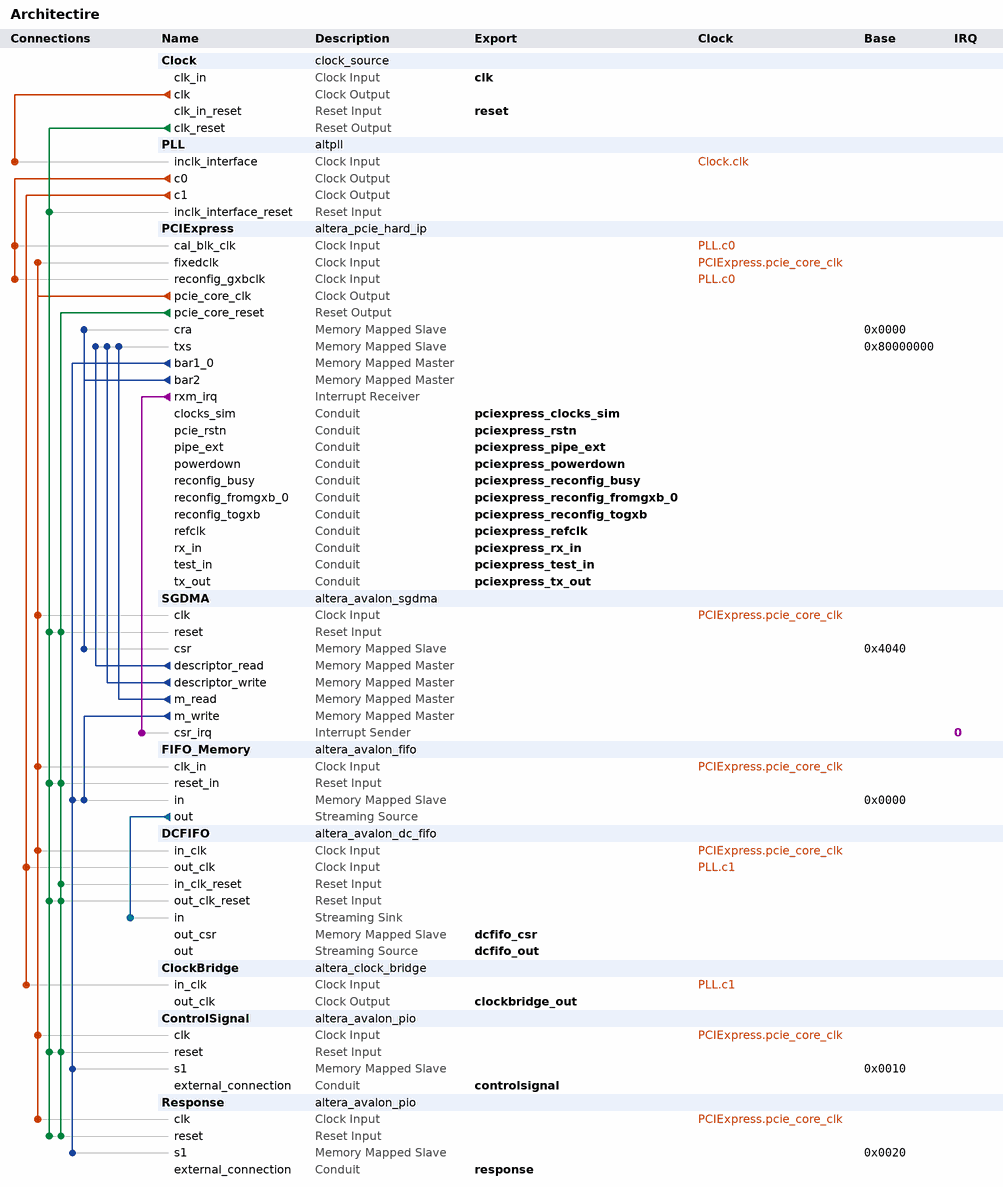
[diagram p0: system contents]
# Platform Designer (Qsys) system Architectire, Cyclone IV GX EP4CGX150DF31C7
# Parameters at their usual value, and those the tool derives, are not listed.
package require -exact qsys 15.0
create_system Architectire
set_project_property DEVICE_FAMILY {Cyclone IV GX}
set_project_property DEVICE EP4CGX150DF31C7

add_instance Clock clock_source 15.0
set_instance_parameter_value Clock clockFrequency 50000000

add_instance PLL altpll 15.0
set_instance_parameter_value PLL CLK0_DIVIDE_BY 1
set_instance_parameter_value PLL CLK0_MULTIPLY_BY 1
set_instance_parameter_value PLL CLK1_DIVIDE_BY 1
set_instance_parameter_value PLL CLK1_DUTY_CYCLE 50
set_instance_parameter_value PLL CLK1_MULTIPLY_BY 4
set_instance_parameter_value PLL CLK1_PHASE_SHIFT 0
set_instance_parameter_value PLL INCLK0_INPUT_FREQUENCY 20000
set_instance_parameter_value PLL PORT_ARESET PORT_UNUSED
set_instance_parameter_value PLL PORT_LOCKED PORT_UNUSED
set_instance_parameter_value PLL PORT_clk1 PORT_USED
set_instance_parameter_value PLL PORT_clk2 PORT_UNUSED
set_instance_parameter_value PLL PORT_clk3 PORT_UNUSED

add_instance PCIExpress altera_pcie_hard_ip 15.0
set_instance_parameter_value PCIExpress {BAR Type} {64 bit Prefetchable,Not used,32 bit Non-Prefetchable,Not used,Not used,Not used}
set_instance_parameter_value PCIExpress CB_A2P_ADDR_MAP_PASS_THRU_BITS 31
set_instance_parameter_value PCIExpress CG_ENABLE_A2P_INTERRUPT 0
set_instance_parameter_value PCIExpress CG_NO_CPL_REORDERING 0
set_instance_parameter_value PCIExpress {PCIe Address 31:0} 0x00000000,0x00000000,0x00000000,0x00000000,0x00000000,0x00000000,0x00000000,0x00000000,0x00000000,0x00000000,0x00000000,0x00000000,0x00000000,0x00000000,0x00000000,0x00000000
set_instance_parameter_value PCIExpress {PCIe Address 63:32} 0x00000000,0x00000000,0x00000000,0x00000000,0x00000000,0x00000000,0x00000000,0x00000000,0x00000000,0x00000000,0x00000000,0x00000000,0x00000000,0x00000000,0x00000000,0x00000000
set_instance_parameter_value PCIExpress class_code 0
set_instance_parameter_value PCIExpress device_id 57345
set_instance_parameter_value PCIExpress max_payload_size 1
set_instance_parameter_value PCIExpress my_advanced_errors false
set_instance_parameter_value PCIExpress my_enable_ecrc_check false
set_instance_parameter_value PCIExpress my_enable_ecrc_gen false
set_instance_parameter_value PCIExpress p_pcie_test_out_width None
set_instance_parameter_value PCIExpress p_pcie_txrx_clock {125 MHz}
set_instance_parameter_value PCIExpress p_user_msi_enable 0
set_instance_parameter_value PCIExpress subsystem_device_id 4
set_instance_parameter_value PCIExpress subsystem_vendor_id 4466
set_instance_parameter_value PCIExpress vendor_id 4466

add_instance SGDMA altera_avalon_sgdma 15.0
set_instance_parameter_value SGDMA enableBurstTransfers false
set_instance_parameter_value SGDMA enableUnalignedTransfers false
set_instance_parameter_value SGDMA readBlockDataWidth 32
set_instance_parameter_value SGDMA sinkErrorWidth 0
set_instance_parameter_value SGDMA sourceErrorWidth 0
set_instance_parameter_value SGDMA transferMode MEMORY_TO_MEMORY
set_instance_parameter_value SGDMA writeBurstcountWidth 4

add_instance FIFO_Memory altera_avalon_fifo 15.0
set_instance_parameter_value FIFO_Memory bitsPerSymbol 32
set_instance_parameter_value FIFO_Memory channelWidth 8
set_instance_parameter_value FIFO_Memory errorWidth 8
set_instance_parameter_value FIFO_Memory fifoDepth 8192
set_instance_parameter_value FIFO_Memory fifoInputInterfaceOptions AVALONMM_WRITE
set_instance_parameter_value FIFO_Memory fifoOutputInterfaceOptions AVALONST_SOURCE
set_instance_parameter_value FIFO_Memory singleClockMode true
set_instance_parameter_value FIFO_Memory symbolsPerBeat 1
set_instance_parameter_value FIFO_Memory useIRQ false
set_instance_parameter_value FIFO_Memory usePacket true
set_instance_parameter_value FIFO_Memory useReadControl false
set_instance_parameter_value FIFO_Memory useWriteControl false

add_instance DCFIFO altera_avalon_dc_fifo 15.0
set_instance_parameter_value DCFIFO BITS_PER_SYMBOL 32
set_instance_parameter_value DCFIFO FIFO_DEPTH 65536
set_instance_parameter_value DCFIFO RD_SYNC_DEPTH 32
set_instance_parameter_value DCFIFO USE_OUT_FILL_LEVEL 1
set_instance_parameter_value DCFIFO USE_PACKETS 1
set_instance_parameter_value DCFIFO WR_SYNC_DEPTH 32

add_instance ClockBridge altera_clock_bridge 15.0
set_instance_parameter_value ClockBridge DERIVED_CLOCK_RATE 200000000
set_instance_parameter_value ClockBridge EXPLICIT_CLOCK_RATE 200000000

add_instance ControlSignal altera_avalon_pio 15.0
set_instance_parameter_value ControlSignal direction Output
set_instance_parameter_value ControlSignal width 1

add_instance Response altera_avalon_pio 15.0
set_instance_parameter_value Response direction Input
set_instance_parameter_value Response simDoTestBenchWiring true
set_instance_parameter_value Response width 11

# connections
add_connection Clock.clk PLL.inclk_interface clock
add_connection PCIExpress.pcie_core_clk ControlSignal.clk clock
add_connection PCIExpress.pcie_core_clk DCFIFO.in_clk clock
add_connection PCIExpress.pcie_core_clk FIFO_Memory.clk_in clock
add_connection PCIExpress.pcie_core_clk PCIExpress.fixedclk clock
add_connection PCIExpress.pcie_core_clk Response.clk clock
add_connection PCIExpress.pcie_core_clk SGDMA.clk clock
add_connection PLL.c0 PCIExpress.cal_blk_clk clock
add_connection PLL.c0 PCIExpress.reconfig_gxbclk clock
add_connection PLL.c1 ClockBridge.in_clk clock
add_connection PLL.c1 DCFIFO.out_clk clock
add_connection Clock.clk_reset ControlSignal.reset reset
add_connection Clock.clk_reset DCFIFO.out_clk_reset reset
add_connection Clock.clk_reset FIFO_Memory.reset_in reset
add_connection Clock.clk_reset PLL.inclk_interface_reset reset
add_connection Clock.clk_reset Response.reset reset
add_connection Clock.clk_reset SGDMA.reset reset
add_connection PCIExpress.pcie_core_reset ControlSignal.reset reset
add_connection PCIExpress.pcie_core_reset DCFIFO.in_clk_reset reset
add_connection PCIExpress.pcie_core_reset DCFIFO.out_clk_reset reset
add_connection PCIExpress.pcie_core_reset FIFO_Memory.reset_in reset
add_connection PCIExpress.pcie_core_reset Response.reset reset
add_connection PCIExpress.pcie_core_reset SGDMA.reset reset
add_connection PCIExpress.bar1_0 ControlSignal.s1 avalon
set_connection_parameter_value PCIExpress.bar1_0/ControlSignal.s1 baseAddress 0x0010
add_connection PCIExpress.bar1_0 FIFO_Memory.in avalon
set_connection_parameter_value PCIExpress.bar1_0/FIFO_Memory.in baseAddress 0x0000
add_connection PCIExpress.bar1_0 Response.s1 avalon
set_connection_parameter_value PCIExpress.bar1_0/Response.s1 baseAddress 0x0020
add_connection PCIExpress.bar2 PCIExpress.cra avalon
set_connection_parameter_value PCIExpress.bar2/PCIExpress.cra baseAddress 0x0000
add_connection PCIExpress.bar2 SGDMA.csr avalon
set_connection_parameter_value PCIExpress.bar2/SGDMA.csr baseAddress 0x4040
add_connection SGDMA.descriptor_read PCIExpress.txs avalon
set_connection_parameter_value SGDMA.descriptor_read/PCIExpress.txs baseAddress 0x80000000
add_connection SGDMA.descriptor_write PCIExpress.txs avalon
set_connection_parameter_value SGDMA.descriptor_write/PCIExpress.txs baseAddress 0x80000000
add_connection SGDMA.m_read PCIExpress.txs avalon
set_connection_parameter_value SGDMA.m_read/PCIExpress.txs baseAddress 0x80000000
add_connection SGDMA.m_write FIFO_Memory.in avalon
set_connection_parameter_value SGDMA.m_write/FIFO_Memory.in baseAddress 0x0000
add_connection FIFO_Memory.out DCFIFO.in avalon_streaming
add_connection PCIExpress.rxm_irq SGDMA.csr_irq interrupt
set_connection_parameter_value PCIExpress.rxm_irq/SGDMA.csr_irq irqNumber 0

# exported interfaces
add_interface clk clock sink
set_interface_property clk EXPORT_OF Clock.clk_in
add_interface clockbridge_out clock source
set_interface_property clockbridge_out EXPORT_OF ClockBridge.out_clk
add_interface controlsignal conduit end
set_interface_property controlsignal EXPORT_OF ControlSignal.external_connection
add_interface dcfifo_csr avalon slave
set_interface_property dcfifo_csr EXPORT_OF DCFIFO.out_csr
add_interface dcfifo_out avalon_streaming source
set_interface_property dcfifo_out EXPORT_OF DCFIFO.out
add_interface pciexpress_clocks_sim conduit end
set_interface_property pciexpress_clocks_sim EXPORT_OF PCIExpress.clocks_sim
add_interface pciexpress_pipe_ext conduit end
set_interface_property pciexpress_pipe_ext EXPORT_OF PCIExpress.pipe_ext
add_interface pciexpress_powerdown conduit end
set_interface_property pciexpress_powerdown EXPORT_OF PCIExpress.powerdown
add_interface pciexpress_reconfig_busy conduit end
set_interface_property pciexpress_reconfig_busy EXPORT_OF PCIExpress.reconfig_busy
add_interface pciexpress_reconfig_fromgxb_0 conduit end
set_interface_property pciexpress_reconfig_fromgxb_0 EXPORT_OF PCIExpress.reconfig_fromgxb_0
add_interface pciexpress_reconfig_togxb conduit end
set_interface_property pciexpress_reconfig_togxb EXPORT_OF PCIExpress.reconfig_togxb
add_interface pciexpress_refclk conduit end
set_interface_property pciexpress_refclk EXPORT_OF PCIExpress.refclk
add_interface pciexpress_rstn conduit end
set_interface_property pciexpress_rstn EXPORT_OF PCIExpress.pcie_rstn
add_interface pciexpress_rx_in conduit end
set_interface_property pciexpress_rx_in EXPORT_OF PCIExpress.rx_in
add_interface pciexpress_test_in conduit end
set_interface_property pciexpress_test_in EXPORT_OF PCIExpress.test_in
add_interface pciexpress_tx_out conduit end
set_interface_property pciexpress_tx_out EXPORT_OF PCIExpress.tx_out
add_interface reset reset sink
set_interface_property reset EXPORT_OF Clock.clk_in_reset
add_interface response conduit end
set_interface_property response EXPORT_OF Response.external_connection

set_interconnect_requirement {$system} qsys_mm.clockCrossingAdapter HANDSHAKE
set_interconnect_requirement {$system} qsys_mm.enableEccProtection FALSE
set_interconnect_requirement {$system} qsys_mm.insertDefaultSlave FALSE
set_interconnect_requirement {$system} qsys_mm.maxAdditionalLatency 1

save_system Architectire.qsys
